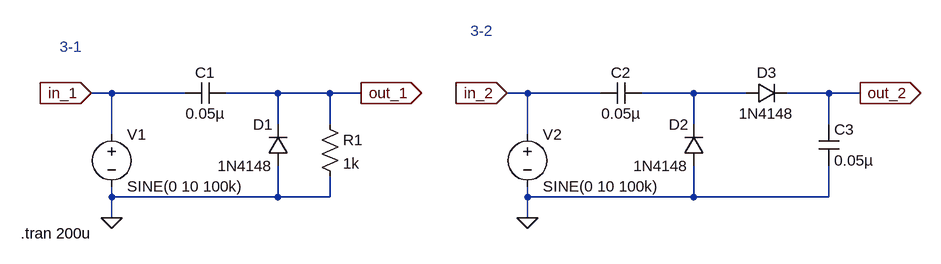
[diagram p0: schematic clamp_circuit.asc]
clamp_circuit.asc, the LTspice schematic file:
Version 4
SHEET 1 1408 680
WIRE 64 80 32 80
WIRE 176 80 64 80
WIRE 320 80 240 80
WIRE 400 80 320 80
WIRE 448 80 400 80
WIRE 704 80 672 80
WIRE 816 80 704 80
WIRE 960 80 880 80
WIRE 1040 80 960 80
WIRE 1168 80 1104 80
WIRE 1216 80 1168 80
WIRE 320 128 320 80
WIRE 400 128 400 80
WIRE 960 128 960 80
WIRE 1168 128 1168 80
WIRE 64 144 64 80
WIRE 704 144 704 80
WIRE 64 240 64 224
WIRE 320 240 320 192
WIRE 320 240 64 240
WIRE 400 240 400 208
WIRE 400 240 320 240
WIRE 704 240 704 224
WIRE 960 240 960 192
WIRE 960 240 704 240
WIRE 1168 240 1168 192
WIRE 1168 240 960 240
WIRE 64 272 64 240
WIRE 704 272 704 240
FLAG 64 272 0
FLAG 32 80 in_1
IOPIN 32 80 In
FLAG 448 80 out_1
IOPIN 448 80 Out
FLAG 704 272 0
FLAG 672 80 in_2
IOPIN 672 80 In
FLAG 1216 80 out_2
IOPIN 1216 80 Out
SYMBOL voltage 64 128 R0
WINDOW 123 0 0 Left 0
WINDOW 39 0 0 Left 0
SYMATTR InstName V1
SYMATTR Value SINE(0 10 100k)
SYMBOL cap 240 64 R90
WINDOW 0 0 32 VBottom 2
WINDOW 3 32 32 VTop 2
SYMATTR InstName C1
SYMATTR Value 0.05µ
SYMBOL diode 336 192 R180
WINDOW 0 24 64 Left 2
WINDOW 3 24 0 Left 2
SYMATTR InstName D1
SYMATTR Value 1N4148
SYMBOL res 384 112 R0
SYMATTR InstName R1
SYMATTR Value 1k
SYMBOL voltage 704 128 R0
WINDOW 123 0 0 Left 0
WINDOW 39 0 0 Left 0
SYMATTR InstName V2
SYMATTR Value SINE(0 10 100k)
SYMBOL cap 880 64 R90
WINDOW 0 0 32 VBottom 2
WINDOW 3 32 32 VTop 2
SYMATTR InstName C2
SYMATTR Value 0.05µ
SYMBOL diode 976 192 R180
WINDOW 0 24 64 Left 2
WINDOW 3 24 0 Left 2
SYMATTR InstName D2
SYMATTR Value 1N4148
SYMBOL diode 1040 96 R270
WINDOW 0 32 32 VTop 2
WINDOW 3 0 32 VBottom 2
SYMATTR InstName D3
SYMATTR Value 1N4148
SYMBOL cap 1152 128 R0
SYMATTR InstName C3
SYMATTR Value 0.05µ
TEXT -76 296 Left 2 !.tran 200u
TEXT -16 8 Left 2 ;3-1
TEXT 616 -16 Left 2 ;3-2

The netlist it stands for:
* clamp_circuit.asc
V1 in_1 0 SINE(0 10 100k)
C1 out_1 in_1 0.05µ
D1 0 out_1 1N4148
R1 out_1 0 1k
V2 in_2 0 SINE(0 10 100k)
C2 N001 in_2 0.05µ
D2 0 N001 1N4148
D3 N001 out_2 1N4148
C3 out_2 0 0.05µ
.model D D
.lib standard.dio
.tran 200u
* 3-1
* 3-2
.backanno
.end

* Results of the author's LTspice run, read from the files saved beside the schematic
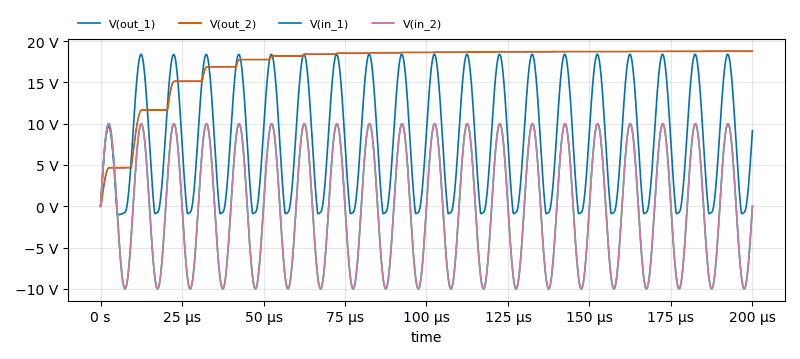
[diagram p1: Transient Analysis of clamp_circuit.asc, plotted from the saved traces]
* Transient Analysis, 1 run:
*   V(out_1): min -1.019 V, max 18.41 V, average 8.261 V, rms 10.77 V, last 9.154 V
*   V(out_2): min 0 V, max 18.78 V, average 17.19 V, rms 17.54 V, last 18.78 V
*   V(in_1): min -10 V, max 10 V, average -646.3 µV, rms 7.075 V, last 0 V
*   V(in_2): min -10 V, max 10 V, average -646.3 µV, rms 7.075 V, last 0 V